# Altium schematic sheet Microcontroller.SchDoc
size A4; SheetNumber: 3; SheetTotal: 4
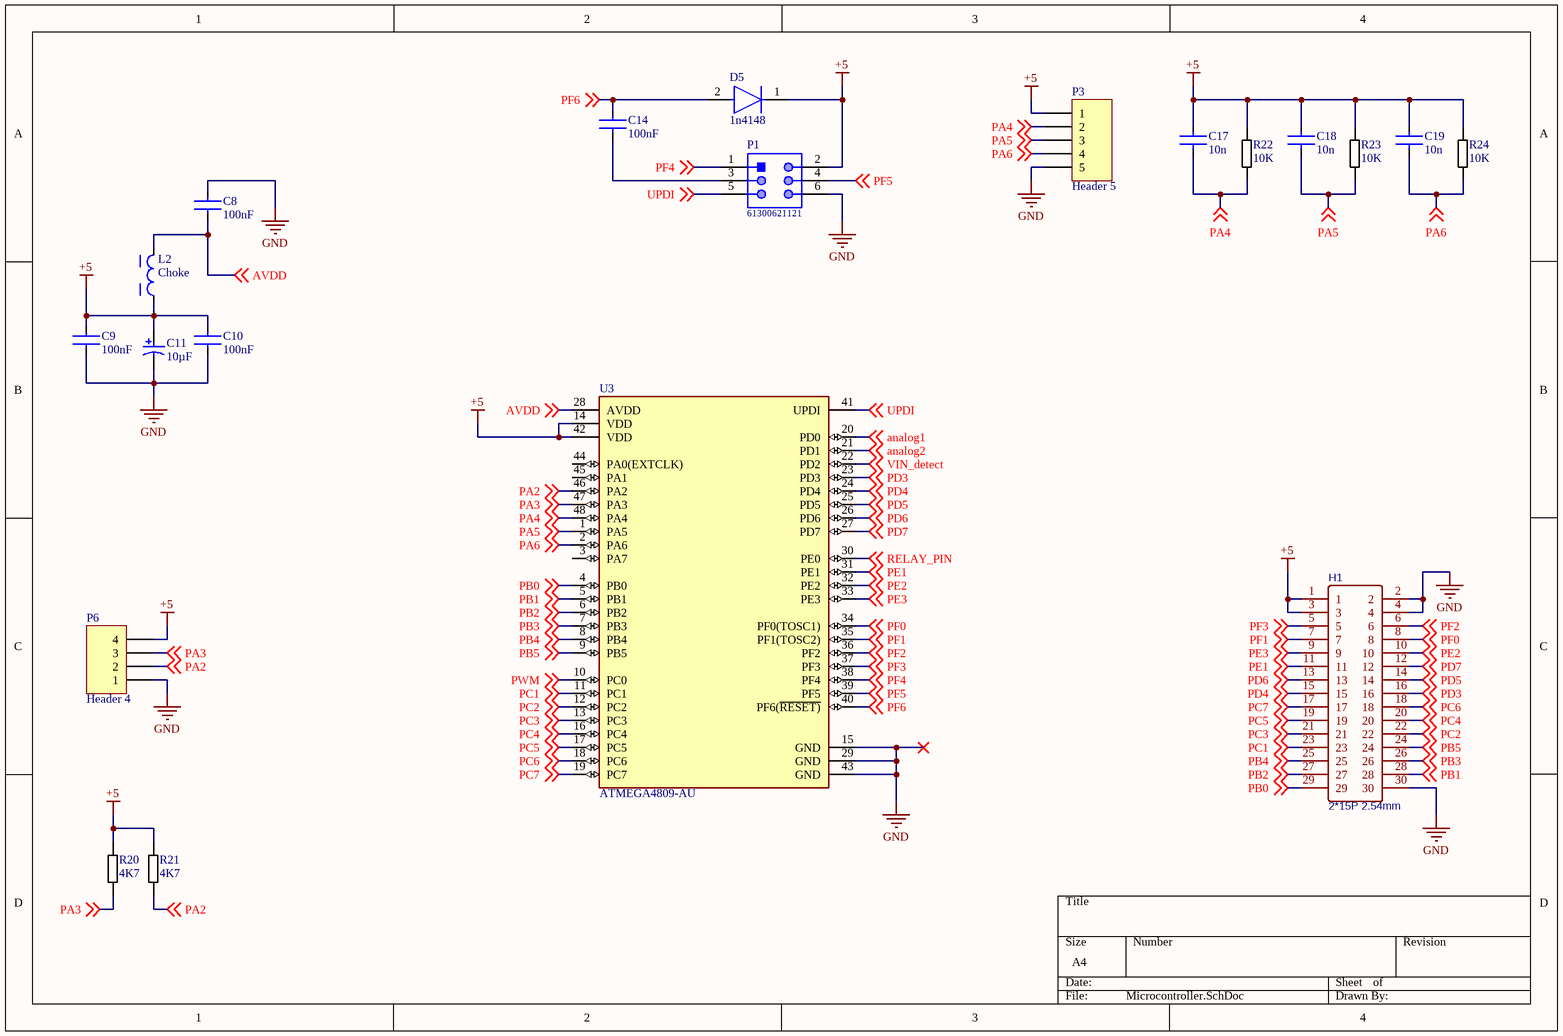
[diagram p0: Microcontroller.SchDoc]

## Parts
C8  100nF  [RESC2013X50X30ML20T20]
C9  100nF  [RESC2013X50X30ML20T20]
C10  100nF  [RESC2013X50X30ML20T20]
C11  10µF  [CAP-SMD_BD4.0-L4.3-W4.3-FD-LS5.3]
C14  100nF  [RESC2013X50X30ML20T20]
C17  10n  [RESC2013X50X30ML20T20]
C18  10n  [RESC2013X50X30ML20T20]
C19  10n  [RESC2013X50X30ML20T20]
D5  1n4148  [SOD-123FL]
H1  2*15P 2.54mm  [HDR-TH_30P-P2.54-V-M-R2-C15-S2.54]
L2  Choke  [RESC2013X50X30ML20T20]
P1  61300621121  [61300621121]
P3  Header 5  [HDR1X5]
P6  Header 4  [HDR1X4]
R20  4K7  [RESC2013X50X30ML20T20]
R21  4K7  [RESC2013X50X30ML20T20]
R22  10K  [RESC2013X50X30ML20T20]
R23  10K  [RESC2013X50X30ML20T20]
R24  10K  [RESC2013X50X30ML20T20]
U3  ATMEGA4809-AU  [FP-C04-300-PT-IPC_A]

## Nets
+5: C9.1 C10.1 C11.1(+) C17.1 C18.1 C19.1 D5.1(C) H1.1 H1.3 L2.1 P1.2 P3.1 P6.4 R20.2 R21.2 R22.2 R23.2 R24.2 U3.14(VDD) U3.42(VDD)
GND: C8.1 C9.2 C10.2 C11.2(-) H1.2 H1.4 H1.30 P1.6 P3.5 P6.1 U3.15(GND) U3.29(GND) U3.43(GND)
analog1: U3.20(PD0) ; off-sheet analog1
analog2: U3.21(PD1) ; off-sheet analog2
AVDD: C8.2 L2.2 U3.28(AVDD) ; off-sheet AVDD
PA2: P6.2 R21.1 U3.46(PA2) ; off-sheet PA2
PA3: P6.3 R20.1 U3.47(PA3) ; off-sheet PA3
PA4: C17.2 P3.2 R22.1 U3.48(PA4) ; off-sheet PA4
PA5: C18.2 P3.3 R23.1 U3.1(PA5) ; off-sheet PA5
PA6: C19.2 P3.4 R24.1 U3.2(PA6) ; off-sheet PA6
PB0: H1.29 U3.4(PB0) ; off-sheet PB0
PB1: H1.28 U3.5(PB1) ; off-sheet PB1
PB2: H1.27 U3.6(PB2) ; off-sheet PB2
PB3: H1.26 U3.7(PB3) ; off-sheet PB3
PB4: H1.25 U3.8(PB4) ; off-sheet PB4
PB5: H1.24 U3.9(PB5) ; off-sheet PB5
PC1: H1.23 U3.11(PC1) ; off-sheet PC1
PC2: H1.22 U3.12(PC2) ; off-sheet PC2
PC3: H1.21 U3.13(PC3) ; off-sheet PC3
PC4: H1.20 U3.16(PC4) ; off-sheet PC4
PC5: H1.19 U3.17(PC5) ; off-sheet PC5
PC6: H1.18 U3.18(PC6) ; off-sheet PC6
PC7: H1.17 U3.19(PC7) ; off-sheet PC7
PD3: H1.16 U3.23(PD3) ; off-sheet PD3
PD4: H1.15 U3.24(PD4) ; off-sheet PD4
PD5: H1.14 U3.25(PD5) ; off-sheet PD5
PD6: H1.13 U3.26(PD6) ; off-sheet PD6
PD7: H1.12 U3.27(PD7) ; off-sheet PD7
PE1: H1.11 U3.31(PE1) ; off-sheet PE1
PE2: H1.10 U3.32(PE2) ; off-sheet PE2
PE3: H1.9 U3.33(PE3) ; off-sheet PE3
PF0: H1.8 U3.34(PF0(TOSC1)) ; off-sheet PF0
PF1: H1.7 U3.35(PF1(TOSC2)) ; off-sheet PF1
PF2: H1.6 U3.36(PF2) ; off-sheet PF2
PF3: H1.5 U3.37(PF3) ; off-sheet PF3
PF4: P1.1 U3.38(PF4) ; off-sheet PF4
PF5: P1.4 U3.39(PF5) ; off-sheet PF5
PF6: C14.1 D5.2(A) U3.40(PF6(~{RESET)}) ; off-sheet PF6
PWM: U3.10(PC0) ; off-sheet PWM
RELAY_PIN: U3.30(PE0) ; off-sheet RELAY_PIN
UPDI: P1.5 U3.41(UPDI) ; off-sheet UPDI
VIN_detect: U3.22(PD2) ; off-sheet VIN_detect
NetC14_2: C14.2 P1.3

Not connected (* = marked no-connect by the designer): U3 3(PA7) 44(PA0(EXTCLK)) 45(PA1)

## Library data of the parts
C8-C10 C14 C17-C19 = Capacitor: Voltage Rating (DC): 6.3V; Dielectric: X5R; Capacitance: 10uF; Material: Ceramic; Tolerance: 20%; Packaging: Tape and Reel; Width: 0.031inch; Termination: SMD/SMT; Package Quantity: 4000; Voltage Rating: 6.3V; Case/Package: 0603; Min Operating Temperature: -55°C; Voltage: 6.3V; Length: 1.6mm; Thickness: 0.035inch; Lead Free: Lead Free; Depth: 0.8mm; Case Code (Imperial): 0603; Max Operating Temperature: 85°C; Height: 0.8mm; Mount: Surface Mount; REACH SVHC: No SVHC; Radiation Hardening: No; Case Code (Metric): 1608
C11 = Electrolytic capacitor: Manufacturer: Panasonic; Voltage Rating: 25 V; ComponentLink2URL: http://industrial.panasonic.com/cdbs/www-data/pdf/RDE0000/ABA0000C1181.pdf; Height: 10.2 mm; Max Operating Temperature: 105 degC; PackageReference: EEE-FK1E221P; ComponentLink1Description: Manufacturer URL; ComponentLink1URL: http://www.panasonic.com/; Mount: Surface Mount; REACH SVHC: No SVHC; Min Operating Temperature: -55 degC; ComponentLink2Description: Datasheet; DatasheetVersion: 03/2016; Length: 10.2 mm; RoHSCompliant: true; Packaging: Tape and Reel; Package Quantity: 500; Lead Pitch: 3.1 mm; Pins: 2; PackageDescription: 2-Pin Electrolytic Aluminum Capacitor, Body 8.3 x 8.3 mm; Mounting Technology: Surface Mount
D5 = Diode: Manufacturer: Vishay; Manufacturer Part Number: 1N4007-E3/54; Value: 15pF; Max Junction Temp: +150°C; Max Surge Forward Current: 30A; Forward Current: 1A; Max Repetitive Reverse Voltage: 1000V; Peak Reverse Current: 30uA; Octopart: https://octopart.com/1n4007-e3%2F54-vishay-39548207; Digikey Description: DIODE GEN PURP 1KV 1A DO204AL; Category: Diode; Mouser Description: Rectifiers Vr/1000V Io/1A; Automotive: No; Package: 1N4007; Device Class L3: Rectifier Diodes; Temperature Range High: +150°C; Capacitance: 15pF; Ipc Land Pattern Name: DIOPA1088W105L520D270; Lead Free: Yes; ComponentLink2Description: Datasheet; Device Class L1: Discrete Semiconductors; ComponentLink2URL: http://www.vishay.com/docs/88503/1n4001.pdf; Temperature Range Low: -50°C; Height: 2.7mm; RoHS: TRUE; Temperature: -50°C to +150°C; Device Class L2: Diodes
H1 = 2*15P 2.54mm: BOM_Manufacturer: Ckmtw(灿科盟); BOM_Manufacturer Part: B-2100S30P-B110; Contributor: LCSC; BOM_Supplier: LCSC; BOM_Supplier Part: C169817; BOM_JLCPCB Part Class: Extended Part; spicePre: H; spiceSymbolName: 2*15P 2.54mm
L2 = Choke: Tolerance: 20%; Shielding: Shielded; Saturation Current: 10A; Test Frequency: 100kHz; RMS Current (Irms): 8.5A; Inductance: 10uH; Series Resistance: 14.1R; DC Resistance (DCR): 14.1mR; Self Resonant Frequency: 18MHz; Ratings: AEC-Q200; Width: 12.8mm; Series: WE-HCI; Length: 0.512inch; Mount: Surface Mount; Resistor Type: Wirewound; RoHS Compliant: Yes; Package Quantity: 1; Min Operating Temperature: -40°C; Inductance Tolerance: 20%; Termination: SMD/SMT; Max DC Current: 8.5A; Height - Seated (Max): 0.197inch; Case/Package: 1350; Current Rating: 8.5A; Max Operating Temperature: 155°C; Packaging: Tape and Reel; Height: 4.7mm
P1 = CMP-1502-01072-1: THT Vertical Pin Header WR-PHD, Pitch 2.54 mm, Dual Row, 6 pins; Manufacturer: Wurth Elektronik; Contact Resistance: 20mOhm; Withstanding Voltage: 500VAC; Pin Number: 6; Gender: Male; Pitch: 2.54mm; Working Voltage: 250VAC; Rated Current: 3A; Packaging: Bag; Row Number: Dual; Manufacturer URL: http://www.we-online.de; Part Number: 61300621121; Operating Temperature: -40to105degC; Mounting Technology: THT; Package Reference: 61300621121; Datasheet URL: https://katalog.we-online.de/em/datasheet/6130xx21121.pdf; Orientation: Vertical; Publisher: WurthElektronik
P3 = Header 5: Header, 5-Pin; LatestRevisionDate: 17-Jul-2002; LatestRevisionNote: Re-released for DXP Platform.; Publisher: Altium Limited
P6 = Header 4: Header, 4-Pin; LatestRevisionDate: 17-Jul-2002; LatestRevisionNote: Re-released for DXP Platform.; Publisher: Altium Limited
R20-R24 = Resistor: Manufacturer: Vishay Dale; Part Number: CRCW08050000Z0EA
U3 = MCU: MCU 8-BIT; Peripherals: Brown-out Detect/Reset; Number of I/Os: 41; Core Architecture: AVR; Memory Size: 48KB; Interface: I2C; Oscillator Type: Internal; Memory Type: FLASH; Series: megaAVR® 0, Functional Safety (FuSa); Min Operating Temperature: -40°C; Mount: Surface Mount; Case/Package: TQFP; RoHS Compliant: Yes; Max Operating Temperature: 85°C